# EAGLE design main_board (EAGLE 7.2.0)
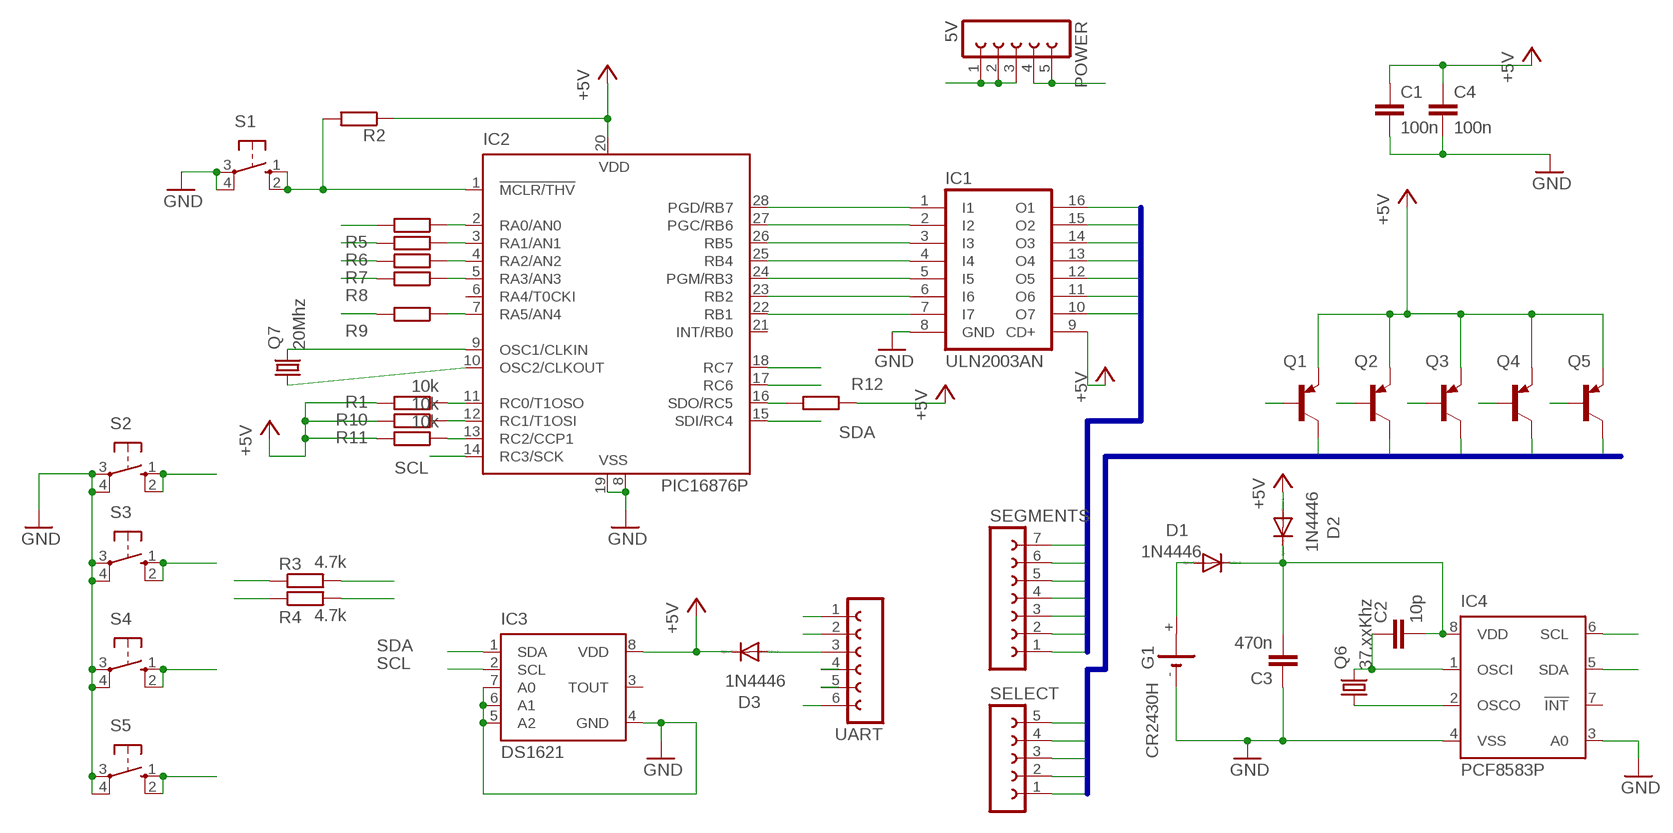
[diagram p0: schematic, sheet 1]

## Parts
C1  100n  C-EU025-030X050  [C025-030X050]
C2  10p  C-EU025-030X050  [C025-030X050]
C3  470n  C-EU025-030X050  [C025-030X050]
C4  100n  C-EU025-030X050  [C025-030X050]
D1  1N4446  [DO35-10]
D2  1N4446  [DO35-10]
D3  1N4446  [DO35-10]
G1  CR2430H  [CR2430H]
IC1  ULN2003AN  [DIL16]
IC2  PIC16876P  [DIL28-3]
IC3  DS1621  [DIL08]
IC4  PCF8583P  [DIL08]
POWER  5V  FE05-1  [FE05-1]
Q1  BC369  [TO92-BCE]
Q2  BC369  [TO92-BCE]
Q3  BC369  [TO92-BCE]
Q4  BC369  [TO92-BCE]
Q5  BC369  [TO92-BCE]
Q6  37.xxKhz  CRYSTALTC38H  [TC38H]
Q7  20Mhz  CRYSTALHC49U-V  [HC49U-V]
R1  10k  R-EU_0204/7  [0204/7]
R2  R-EU_0204/7  [0204/7]
R3  4.7k  R-EU_0204/7  [0204/7]
R4  4.7k  R-EU_0204/7  [0204/7]
R5  R-EU_0204/7  [0204/7]
R6  R-EU_0204/7  [0204/7]
R7  R-EU_0204/7  [0204/7]
R8  R-EU_0204/7  [0204/7]
R9  R-EU_0204/7  [0204/7]
R10  10k  R-EU_0204/7  [0204/7]
R11  10k  R-EU_0204/7  [0204/7]
R12  R-EU_0204/7  [0204/7]
S1  10-XX  [B3F-10XX]
S2  10-XX  [B3F-10XX]
S3  10-XX  [B3F-10XX]
S4  10-XX  [B3F-10XX]
S5  10-XX  [B3F-10XX]
SEGMENTS  FE07-1  [FE07]
SELECT  FE05-1  [FE05-1]
UART  FE06-1  [FE06]

## Nets
+5V: C1.1 C4.1 D2.A D3.C IC1.9(CD+) IC2.20(VDD) IC3.8(VDD) POWER.1 POWER.2 POWER.3 Q1.E Q2.E Q3.E Q4.E Q5.E R1.2 R2.1 R3.1 R4.1 R10.2 R11.2 R12.1
GND: C1.2 C3.1 C4.2 G1.- IC1.8(GND) IC2.8(VSS) IC2.19(VSS) IC3.4(GND) IC3.5(A2) IC3.6(A1) IC3.7(A0) IC4.3(A0) IC4.4(VSS) POWER.4 POWER.5 S1.3(P) S1.4(P1) S2.3(P) S2.4(P1) S3.3(P) S3.4(P1) S4.3(P) S4.4(P1) S5.3(P) S5.4(P1) UART.1
J_SEG_DATA0: IC1.16(O1) SEGMENTS.7
J_SEG_DATA1: IC1.15(O2) SEGMENTS.6
J_SEG_DATA2: IC1.14(O3) SEGMENTS.5
J_SEG_DATA3: IC1.13(O4) SEGMENTS.4
J_SEG_DATA4: IC1.12(O5) SEGMENTS.3
J_SEG_DATA5: IC1.11(O6) SEGMENTS.2
J_SEG_DATA6: IC1.10(O7) SEGMENTS.1
J_SEG_SELECT0: Q1.C SELECT.5
J_SEG_SELECT1: Q2.C SELECT.4
J_SEG_SELECT2: Q3.C SELECT.3
J_SEG_SELECT3: Q4.C SELECT.2
J_SEG_SELECT4: Q5.C SELECT.1
N$1: IC1.1(I1) IC2.28(PGD/RB7)
N$2: IC1.2(I2) IC2.27(PGC/RB6)
N$3: IC1.3(I3) IC2.26(RB5)
N$4: IC1.4(I4) IC2.25(RB4)
N$5: IC1.5(I5) IC2.24(PGM/RB3)
N$6: C2.1 IC4.1(OSCI) Q6.2
N$7: IC1.7(I7) IC2.22(RB1)
N$8: IC2.1(!MCLR/THV) R2.2 S1.1(S) S1.2(S1)
N$9: IC2.2(RA0/AN0) R5.1
N$10: IC2.10(OSC2/CLKOUT) Q7.1
N$11: IC4.2(OSCO) Q6.1
N$12: D1.A G1.+
N$13: IC1.6(I6) IC2.23(RB2)
N$15: C2.2 C3.2 D1.C D2.C IC4.8(VDD)
N$16: IC2.9(OSC1/CLKIN) Q7.2
N$17: IC2.3(RA1/AN1) R6.1
N$18: IC2.4(RA2/AN2) R7.1
N$19: IC2.5(RA3/AN3) R8.1
N$20: IC2.7(RA5/AN4) R9.1
N$25: UART.2
N$26: D3.A UART.3
N$29: UART.6
SCL: IC2.14(RC3/SCK) IC3.2(SCL) IC4.6(SCL) R4.2
SDA: IC2.15(SDI/RC4) IC3.1(SDA) IC4.5(SDA) R3.2
SEG1: Q1.B R5.2
SEG2: Q2.B R6.2
SEG3: Q3.B R7.2
SEG4: Q4.B R8.2
SEG5: Q5.B R9.2
SW1: IC2.11(RC0/T1OSO) R1.1 S2.1(S) S2.2(S1)
SW2: IC2.12(RC1/T1OSI) R10.1 S3.1(S) S3.2(S1)
SW3: IC2.13(RC2/CCP1) R11.1 S4.1(S) S4.2(S1)
SW4: IC2.16(SDO/RC5) R12.2 S5.1(S) S5.2(S1)
UART_RX: IC2.18(RC7) UART.4
UART_TX: IC2.17(RC6) UART.5
Unconnected: G1.+@1(+) IC2.6(RA4/T0CKI) IC2.21(INT/RB0) IC3.3(TOUT) IC4.7(!INT)

## Buses
J_SEG_DATA[0..6]
J_SEG_SELECT[0..4]

## Library data of the parts
C1-C4 = rcl:C-EU: CAPACITOR, European symbol
D1-D3 = diode:1N4446: DIODE high speed (Philips)
G1 = battery:CR2430H: LI BATTERY Varta
IC1 = uln-udn:ULN2003A: DRIVER ARRAY
IC2 = microchip:PIC16*876: MICROCONTROLLER flash type; OC_FARNELL: unknown; OC_NEWARK: unknown
IC3 = maxim:DS1621: Digital Thermometer and Thermostat Source: http://pdfserv.maxim-ic.com/en/ds/DS1621.pdf; MPN: DS1621; OC_FARNELL: 1188024; OC_NEWARK: 66F3769
IC4 = ds1307_pcf8583:PCF8583: I2C-Bus CLOCK/CALENDAR
POWER SELECT = con-lsta:FE05-1: FEMALE HEADER; OC_FARNELL: unknown; OC_NEWARK: unknown
Q1-Q5 = transistor-pnp:BC369*: PNP Transistror
Q6 = crystal:CRYSTAL: CRYSTAL; OC_FARNELL: unknown; OC_NEWARK: unknown
Q7 = crystal:CRYSTAL: CRYSTAL; OC_FARNELL: 1666969; OC_NEWARK: unknown
R1-R12 = rcl:R-EU_: RESISTOR, European symbol
S1-S5 = switch-omron:10-XX: OMRON SWITCH; MPN: B3F-1000; OC_FARNELL: 176432; OC_NEWARK: 36M3542
SEGMENTS = con-lsta:FE07-1: FEMALE HEADER; OC_FARNELL: unknown; OC_NEWARK: unknown
UART = con-lsta:FE06-1: FEMALE HEADER; OC_FARNELL: unknown; OC_NEWARK: unknown

## Board
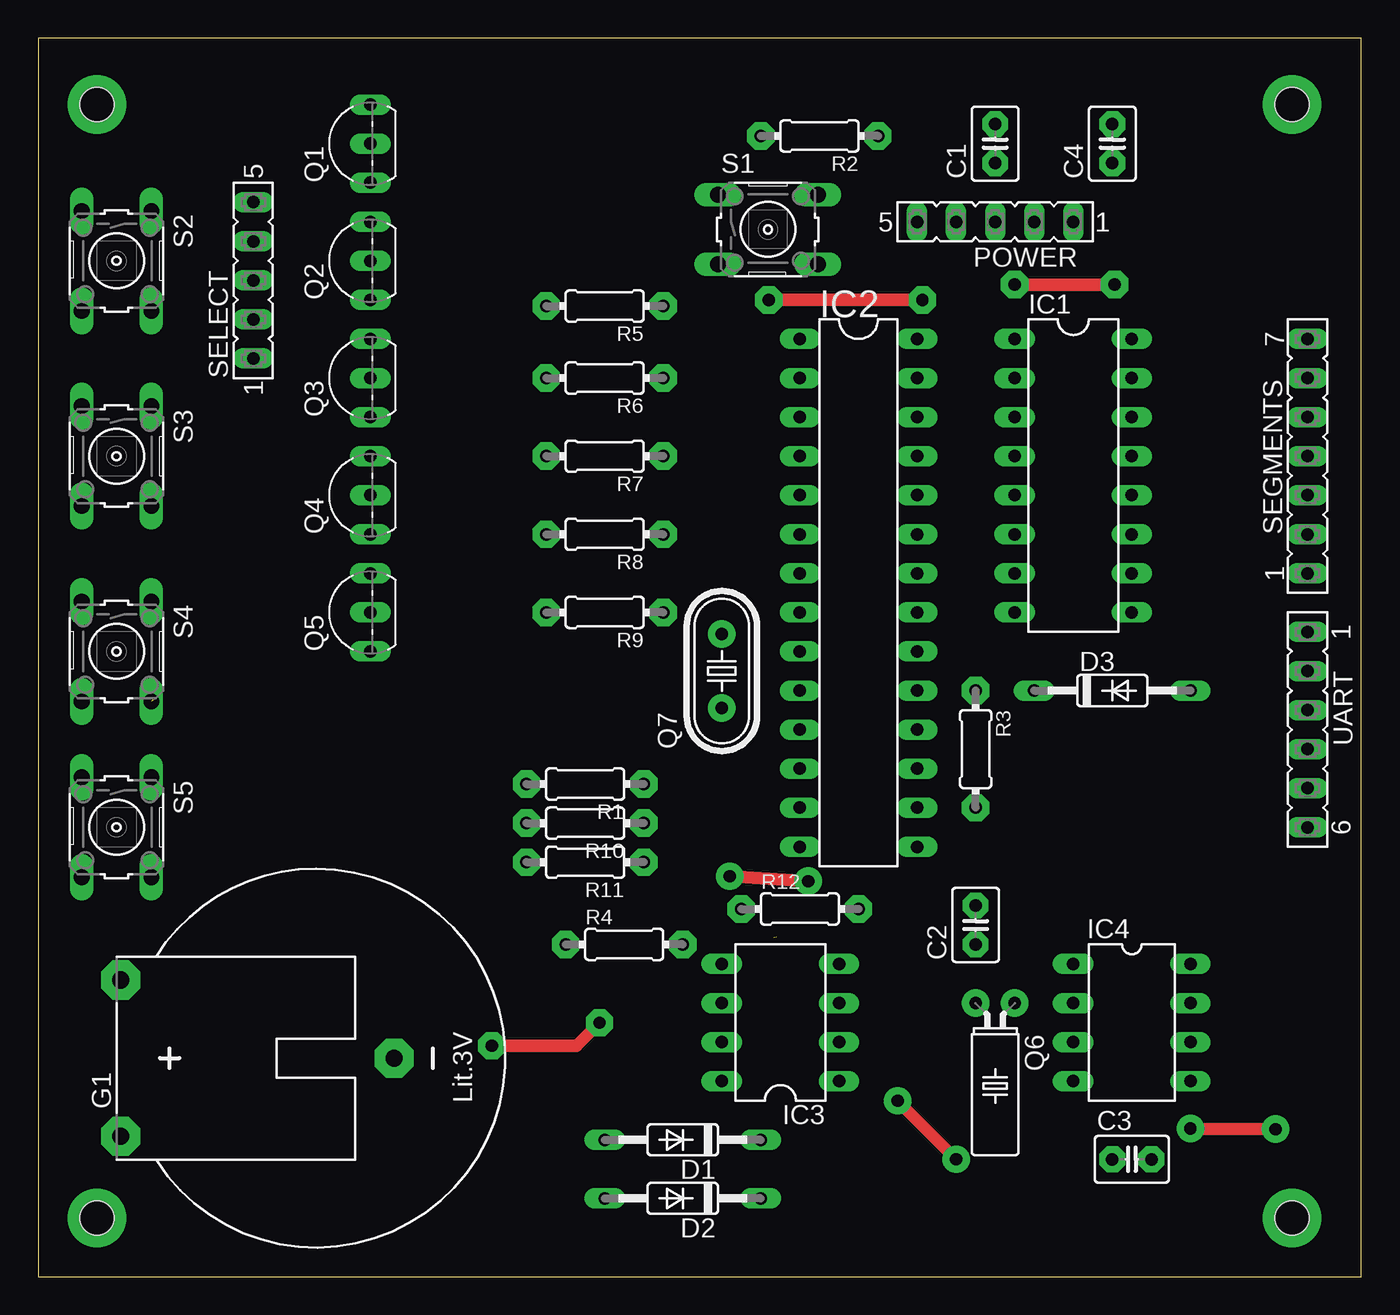
[diagram p1: board, top side]
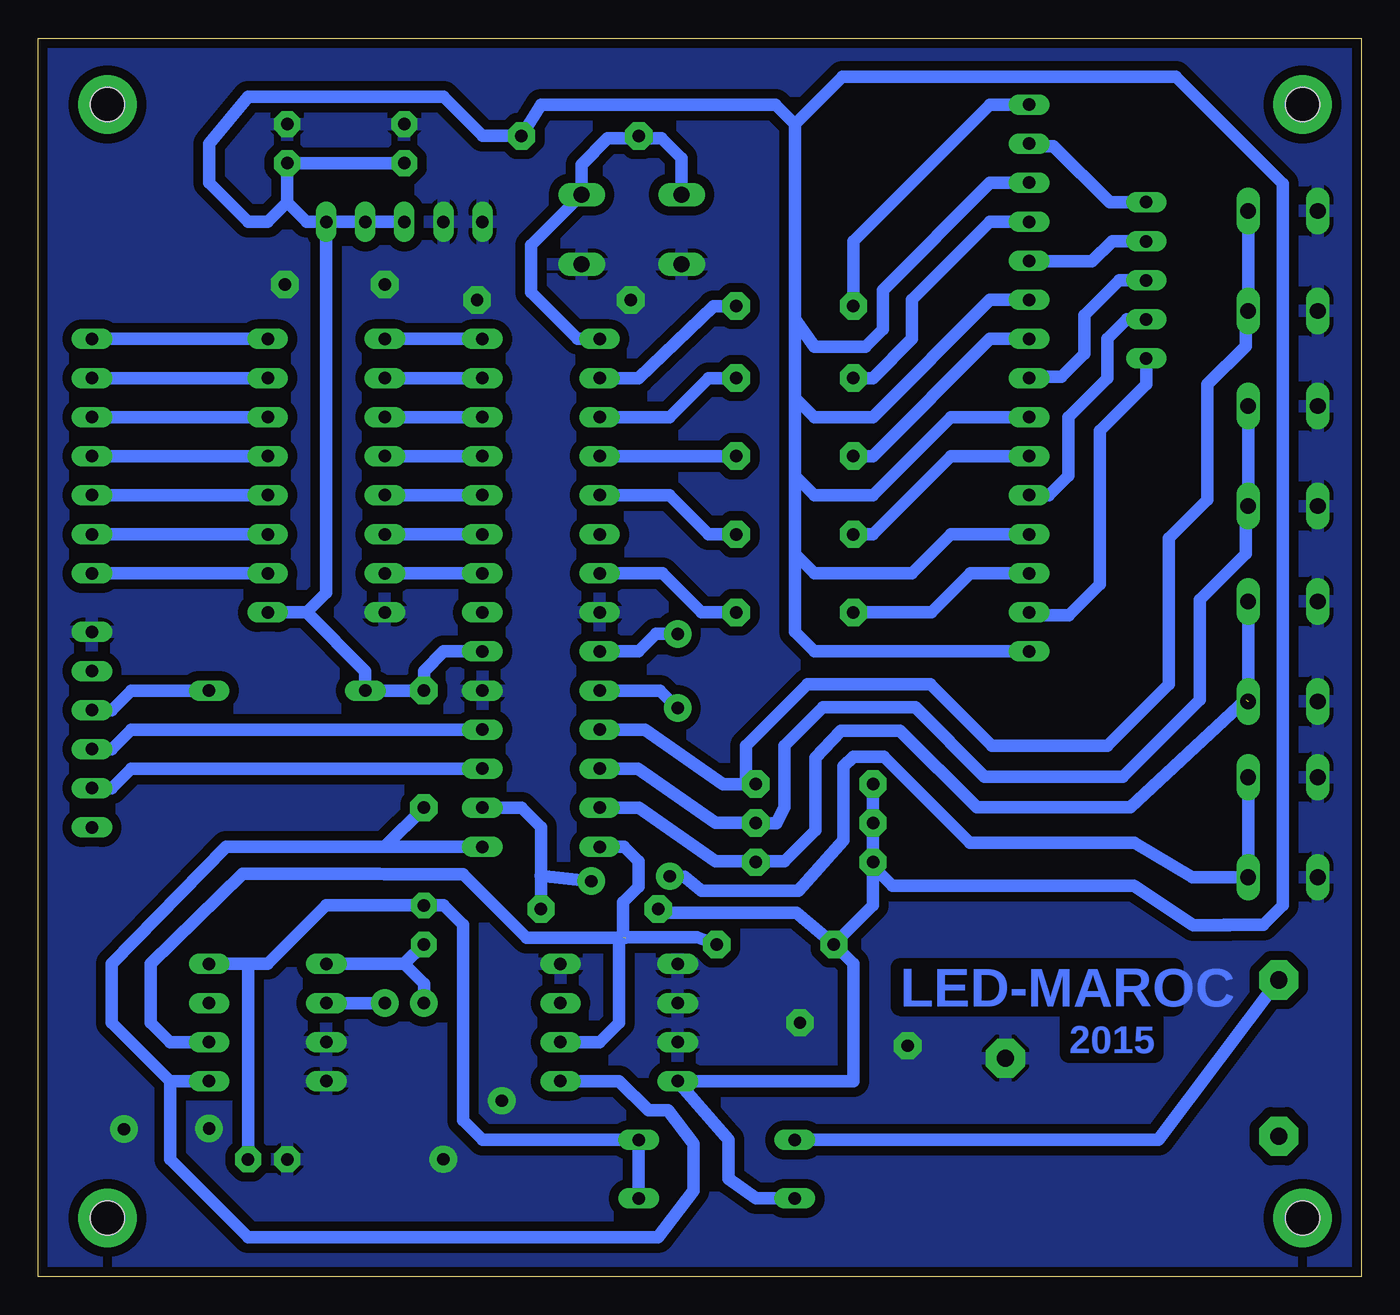
[diagram p2: board, bottom side, seen from below]

Size 86.03 x 80.5 mm. Coordinates in mm from the lower left corner, seen from the top.
Outline: 0,0 86.03,0 86.03,80.5 0,80.5 0,0
Copper layers (1*16): Top 0.035mm / dielectric 1.5mm / Bottom 0.035mm
Design rules "default *": minimum track width 24mil, minimum drill 24mil, track to track 24mil, track to pad 16mil, pad to pad 16mil, via to via 16mil, smd to smd 8mil, copper to edge 24mil, drill to drill 8mil, minimum pad ring 10mil, minimum via ring 8mil, stop-mask expansion 4mil, vias tented up to drill 0mil, thermal gap 10mil
Holes 2.2 mm at 3.81,76.2 3.81,3.81 81.55,3.81 81.55,76.2

### Footprints (pad centres in the part's own frame; a part is rotated, then mirrored left to right if it is on the bottom)
C025-030X050 = drill 0.813 pad 1.676 octagon: 1 -1.27,0; 2 1.27,0
DO35-10 = drill 0.813 long: A 5.08,0; C -5.08,0
CR2430H = drill 1.118 pad 2.54 octagon: + 5.08,12.7; +@1 -5.08,12.7; - 0,-5.08
DIL16 = drill 0.813 long: 1 -8.89,-3.81; 2 -6.35,-3.81; 3 -3.81,-3.81; 4 -1.27,-3.81; 5 1.27,-3.81; 6 3.81,-3.81; 7 6.35,-3.81; 8 8.89,-3.81; 9 8.89,3.81; 10 6.35,3.81; 11 3.81,3.81; 12 1.27,3.81; 13 -1.27,3.81; 14 -3.81,3.81; 15 -6.35,3.81; 16 -8.89,3.81
DIL28-3 = drill 0.813 long: 1 -16.51,-3.81; 2 -13.97,-3.81; 3 -11.43,-3.81; 4 -8.89,-3.81; 5 -6.35,-3.81; 6 -3.81,-3.81; 7 -1.27,-3.81; 8 1.27,-3.81; 9 3.81,-3.81; 10 6.35,-3.81; 11 8.89,-3.81; 12 11.43,-3.81; 13 13.97,-3.81; 14 16.51,-3.81; 15 16.51,3.81; 16 13.97,3.81; 17 11.43,3.81; 18 8.89,3.81; 19 6.35,3.81; 20 3.81,3.81; 21 1.27,3.81; 22 -1.27,3.81; 23 -3.81,3.81; 24 -6.35,3.81; 25 -8.89,3.81; 26 -11.43,3.81; 27 -13.97,3.81; 28 -16.51,3.81
DIL08 = drill 0.813 long: 1 -3.81,-3.81; 2 -1.27,-3.81; 3 1.27,-3.81; 4 3.81,-3.81; 5 3.81,3.81; 6 1.27,3.81; 7 -1.27,3.81; 8 -3.81,3.81
FE05-1 = drill 0.813 long: 1 -5.08,0; 2 -2.54,0; 3 0,0; 4 2.54,0; 5 5.08,0
TO92-BCE = drill 0.813 long: B 2.54,0; C 0,0; E -2.54,0
TC38H = drill 0.813 pad 1.778: 1 -1.27,0; 2 1.27,0
HC49U-V = drill 0.813 pad 1.778: 1 -2.413,0; 2 2.413,0
0204/7 = drill 0.813 pad 1.778 octagon: 1 -3.81,0; 2 3.81,0
B3F-10XX = drill 1.016 long: 1 -3.251,2.261; 2 3.251,2.261; 3 -3.251,-2.261; 4 3.251,-2.261
FE07 = drill 0.813 long: 1 -7.62,0; 2 -5.08,0; 3 -2.54,0; 4 0,0; 5 2.54,0; 6 5.08,0; 7 7.62,0
FE06 = drill 0.813 long: 1 -6.35,0; 2 -3.81,0; 3 -1.27,0; 4 1.27,0; 5 3.81,0; 6 6.35,0

### Placement (x,y rotation side)
C1  62.23,73.66 90 top
C2  60.96,22.86 90 top
C3  71.12,7.62 0 top
C4  69.85,73.66 90 top
D1  41.91,8.89 180 top
D2  41.91,5.08 180 top
D3  69.85,38.1 0 top
G1  18.05,14.2 90 top
IC1  67.31,52.07 270 top
IC2  53.34,44.45 270 top
IC3  48.26,16.51 90 top
IC4  71.12,16.51 270 top
POWER  62.23,68.58 180 top
Q1  21.59,73.66 90 top
Q2  21.59,66.04 90 top
Q3  21.59,58.42 90 top
Q4  21.59,50.8 90 top
Q5  21.59,43.18 90 top
Q6  62.23,17.78 180 top
Q7  44.45,39.37 90 top
R1  35.56,32.02 180 top
R2  50.8,74.16 180 top
R3  60.96,34.29 270 top
R4  38.1,21.59 0 top
R5  36.83,63.1 180 top
R6  36.83,58.42 180 top
R7  36.83,53.34 180 top
R8  36.83,48.26 180 top
R9  36.83,43.18 180 top
R10  35.56,29.48 180 top
R11  35.56,26.94 180 top
R12  49.53,23.89 0 top
S1  47.45,68.08 0 top
S2  5.08,66.04 270 top
S3  5.08,53.34 270 top
S4  5.08,40.64 270 top
S5  5.08,29.21 270 top
SEGMENTS  82.55,53.34 90 top
SELECT  13.97,64.77 90 top
UART  82.55,35.56 270 top

### Tracks (layer width: path | path; a pad name or v marks a point on that pad's centre or on a via)
+5V
  Bottom 0.813: C1.1 C4.1 69.85,69.85 | POWER.1 68.58,68.58 69.85,69.85 | POWER.1 POWER.2 POWER.3 | 69.85,69.85 71.12,68.58 72.39,68.58 74.93,71.12 74.93,73.66 72.39,76.7 59.69,76.7 57.15,74.16 R2.1 53.34,76.2 38.1,76.2 36.83,74.93 | Q1.E 24.13,71.12 31.11,64.14 31.11,61.59 32.25,60.46 35.56,60.46 36.83,62.23 | 36.83,62.23 36.83,74.93 | Q2.E 24.13,63.5 31.75,55.88 35.56,55.88 36.83,57.15 | 36.83,57.15 36.83,62.23 | Q3.E 26.67,55.88 31.75,50.8 35.56,50.8 36.83,52.07 | 36.83,52.07 36.83,57.15 | Q4.E 26.67,48.26 29.21,45.72 35.56,45.72 36.83,46.99 | 36.83,46.99 36.83,52.07 | Q5.E 35.56,40.64 36.83,41.91 36.83,46.99 | D2.A 39.37,5.08 41.14,6.35 41.14,8.89 IC3.8 33.02,12.7 33.02,20.32 R4.1 | IC2.20 59.69,40.64 60.96,39.37 R3.1 D3.C 64.77,39.37 68.58,43.18 | IC1.9 68.58,43.18 | 68.58,43.18 67.31,44.45 POWER.1 | R4.1 31.75,24.13 R11.2 R10.2 R1.2 31.75,26.67 30.48,25.4 14.78,25.4 10.92,22.85 8.57,22.85 8.89,22.86 6.35,22.86 5.08,24.13 5.08,71.04 12.06,78.01 33.75,78.01 36.83,74.93 | R4.1 36.74,23.64 45.72,23.64 R12.1
GND  (via drill 0.8 pad 1.78)
  Top 0.813: v55.88,11.43 v59.69,7.62 | v74.93,9.62 v80.47,9.58 | v47.5,63.5 v57.5,63.5 | v63.5,64.5 v70,64.5 | v29.5,15 35,15 v36.5,16.5
  pour Bottom: 0,81.01 86.36,81.01 86.36,0 0,0
J_SEG_DATA0
  Bottom 0.813: IC1.16 SEGMENTS.7
J_SEG_DATA1
  Bottom 0.813: IC1.15 SEGMENTS.6
J_SEG_DATA2
  Bottom 0.813: IC1.14 SEGMENTS.5
J_SEG_DATA3
  Bottom 0.813: IC1.13 SEGMENTS.4
J_SEG_DATA4
  Bottom 0.813: IC1.12 SEGMENTS.3
J_SEG_DATA5
  Bottom 0.813: IC1.11 SEGMENTS.2
J_SEG_DATA6
  Bottom 0.813: IC1.10 SEGMENTS.1
J_SEG_SELECT0
  Bottom 0.813: SELECT.5 16.35,69.85 20,73.5 21.43,73.5 Q1.C
J_SEG_SELECT1
  Bottom 0.813: SELECT.4 16.19,67.31 17.5,66 21.55,66 Q2.C
J_SEG_SELECT2
  Bottom 0.813: SELECT.3 15.73,64.77 18,62.5 18,60 19.5,58.5 21.51,58.5 Q3.C
J_SEG_SELECT3
  Bottom 0.813: Q4.C 20.32,50.8 19.05,52.07 19.05,55.88 16.51,58.42 16.51,60.96 15.24,62.23 SELECT.2
J_SEG_SELECT4
  Bottom 0.813: SELECT.1 13.97,58.03 17,55 17,45 19,43 21.41,43 Q5.C
N$1
  Bottom 0.813: IC1.1 IC2.28
N$2
  Bottom 0.813: IC2.27 IC1.2
N$3
  Bottom 0.813: IC1.3 IC2.26
N$4
  Bottom 0.813: IC2.25 IC1.4
N$5
  Bottom 0.813: IC1.5 IC2.24
N$6
  Bottom 0.813: Q6.2 60.96,19.05 62.23,20.32 | 62.23,20.32 IC4.1 | C2.1 62.23,20.32
N$7
  Bottom 0.813: IC1.7 IC2.22
N$8
  Bottom 0.813: S1.1 44.2,72.7 45.5,74 46.83,74 R2.2 47.15,74 49,74 50.7,72.3 S1.2 54,67.04 54,64 50.96,60.96 IC2.1
N$9
  Bottom 0.813: IC2.2 46.99,58.42 42.11,63.1 R5.1
N$10
  Bottom 0.813: IC2.10 45.59,38.1 Q7.1
N$11
  Bottom 0.813: Q6.1 IC4.2
N$12
  Bottom 0.813: D1.A 13.2,8.89 G1.+
N$13
  Bottom 0.813: IC2.23 IC1.6
N$14  (via drill 2.2 pad 3.81)
  other vias: 81.55,76.2
N$15
  Bottom 0.813: 72.39,20.32 71.12,20.32 67.31,24.13 C2.2 59.69,24.13 58.42,22.86 58.42,10.16 57.15,8.89 D1.C D2.C | 72.39,20.32 IC4.8 | C3.2 72.39,20.32
N$16
  Bottom 0.813: Q7.2 45.85,41.78 46.99,40.64 IC2.9
N$17
  Bottom 0.813: IC2.3 44.99,55.88 42.45,58.42 R6.1
N$18
  Bottom 0.813: IC2.4 R7.1
N$19
  Bottom 0.813: IC2.5 44.99,50.8 42.45,48.26 R8.1
N$20
  Bottom 0.813: IC2.7 45.45,45.72 42.91,43.18 R9.1
N$21  (via drill 2.2 pad 3.81)
  other vias: 81.55,3.81
N$22  (via drill 2.2 pad 3.81)
  other vias: 3.81,3.81
N$23  (via drill 2.2 pad 3.81)
  other vias: 3.81,76.2
N$26
  Bottom 0.813: UART.3 81.28,36.83 80.01,38.1 D3.A
SCL  (1 unrouted)
  Bottom 0.813: IC4.6 77.47,15.24 78.74,16.51 78.74,20.32 72.75,26.17 63.86,26.17 63.5,26.17 58.42,26.17 54.29,22.02 47.84,22.02 | R4.2 43.18,22.06 48,22.06 | IC3.2 49.53,15.24 48.26,16.51 48.26,21.96 48,22.06 | IC2.14 47.94,27.94 47,27 47,25.36 48,24.33 48,22.06
SDA
  Bottom 0.813: IC4.5 77.47,12.7 | 77.47,12.7 81.28,16.51 81.28,20.32 73.82,27.94 64.93,27.94 64.77,27.94 63.5,27.94 | IC3.1 48.26,12.7 46.35,10.79 45.09,10.79 43.41,8.62 43.41,5.58 45.72,2.54 72.39,2.54 77.47,7.62 77.47,12.7 | IC2.15 63.5,27.94 | R3.2 63.5,27.94
SEG1
  Bottom 0.813: R5.2 33.02,67.31 24.13,76.2 Q1.B
SEG2
  Bottom 0.813: R6.2 31.75,58.42 29.21,60.96 29.21,63.5 24.13,68.58 Q2.B
SEG3
  Bottom 0.813: R7.2 31.75,53.34 24.13,60.96 Q3.B
SEG4
  Bottom 0.813: R8.2 31.75,48.26 26.67,53.34 Q4.B
SEG5
  Bottom 0.813: R9.2 27.94,43.18 25.4,45.72 Q5.B
SW1
  Bottom 0.813: S2.1 S2.2 7.5,62.63 7.5,60.5 10,58 10,50.5 12.5,48 12.5,38.5 16.5,34.5 24,34.5 28,38.5 36,38.5 40,34.5 40,32.5 39.37,32.13 R1.1 39.39,32 41.5,32 46.56,35.56 IC2.11
SW2
  Bottom 0.813: IC2.12 47.02,33.02 42,29.5 39.39,29.5 R10.1 38.02,29.48 37.5,30.5 37.5,34.5 35,37 29,37 24.5,32.5 15.5,32.5 10.5,37.5 10.5,44 7.5,47 7.5,49.93 S3.2 S3.1
SW3  (1 unrouted)
  Bottom 0.813: IC2.13 46.98,30.48 42,27 39.43,27 | S4.1 S4.2 | 39.43,27 R11.1 | 39.43,27 37.5,27 35.5,29 35.5,33.74 33.86,35.45 33.81,35.5 30,35.5 25,30.5 15,30.5 7.5,37.5
SW4  (via drill 0.8 pad 1.78)
  Top 0.813: v44.96,26.02 v50.07,25.7
  Bottom 0.813: IC2.16 54.61,30.48 53.34,29.21 53.34,26 | 53.34,26 R12.2 | S5.1 S5.2 10.99,25.96 14.74,28.21 25.44,28.21 31.02,33.79 33.02,33.79 33.67,33.17 33.67,28.36 36.58,25.07 42.89,25.07 44,26 44.86,26 v44.96,26.02 | v50.07,25.7 53.36,26.05 53.34,26
UART_RX
  Bottom 0.813: IC2.18 80.01,35.56 81.28,34.29 UART.4
UART_TX
  Bottom 0.813: IC2.17 80.01,33.02 81.28,31.75 UART.5

### Text on the board
Bottom: LED-MAROC | 2015